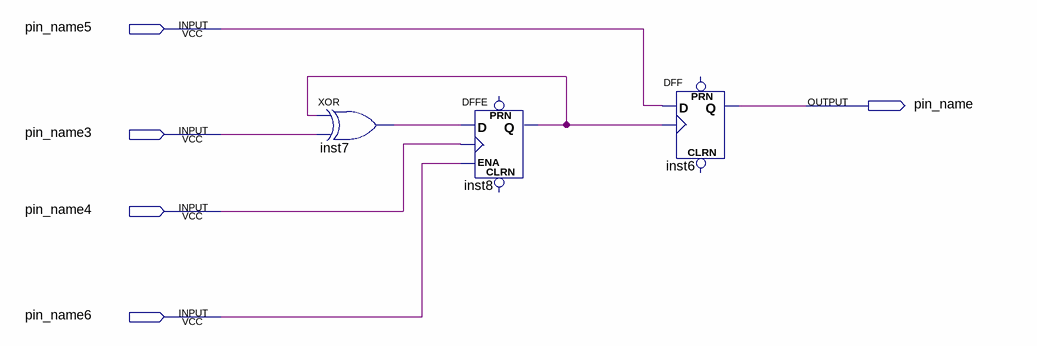
[diagram p0: schematic sheet]
// Quartus schematic PROVA.bdf as structural Verilog: 3 symbols, 5 pins
module PROVA (
  input  pin_name5,
  input  pin_name3,
  input  pin_name4,
  input  pin_name6,
  output pin_name
);

  wire inst7_out, inst8_q;

  xor inst7 (inst7_out, inst8_q, pin_name3);
  DFFE inst8 (.D(inst7_out), .CLK(pin_name4), .ENA(pin_name6), .Q(inst8_q));  // open: PRN, CLRN
  DFF inst6 (.CLK(inst8_q), .D(pin_name5), .Q(pin_name));  // open: CLRN, PRN
endmodule
